# Altium schematic sheet Converter.SchDoc: 24-12V 3A Converter TPS62933
size A4; DrawnBy: EEE Patrick; Organization: PERT; Revision: A; SheetNumber: 1; SheetTotal: 1; Version: 1; Sub Team: EEE; Module: Converter; Generation: NA
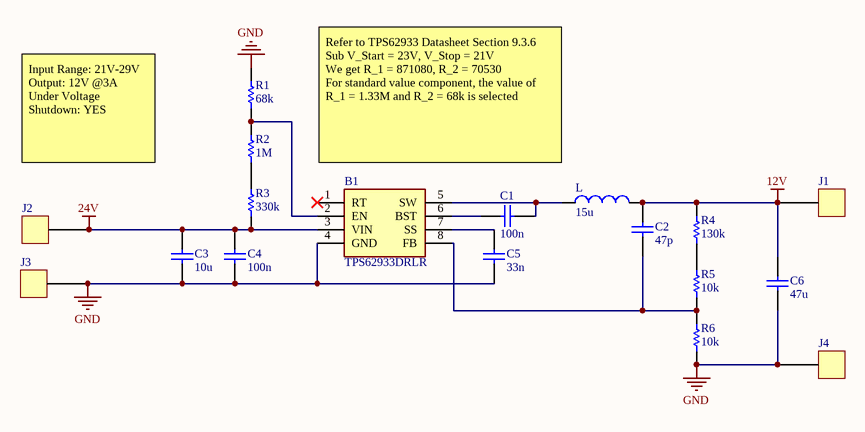
[diagram p0: Converter.SchDoc]

## Parts
B1  TPS62933DRLR  [SOT583_TPS62933]
C1  100n  [0603_SMD_C]
C2  47p  [0603_SMD_C]
C3  10u  [1206_SMD_C]
C4  100n  [0805_SMD_C]
C5  33n  [0603_SMD_C]
C6  47u  [1210_SMD_C]
J1  CastellatedHoles  [CastellatedHole]  (value not drawn)  (no BOM)
J2  CastellatedHoles  [CastellatedHole]  (value not drawn)  (no BOM)
J3  CastellatedHoles  [CastellatedHole]  (value not drawn)  (no BOM)
J4  CastellatedHoles  [CastellatedHole]  (value not drawn)  (no BOM)
L  15u  [DR127_SMD_L]
R1  68k  [0603_SMD_R]
R2  1M  [0603_SMD_R]
R3  330k  [0603_SMD_R]
R4  130k  [0603_SMD_R]
R5  10k  [0603_SMD_R]
R6  10k  [0603_SMD_R]

## Nets
12V: C2.2 C6.2 J1.1 L.1 R4.2
24V: B1.3(VIN) C3.2 C4.2 J2.1 R3.1
GND: B1.4(GND) C3.1 C4.1 C5.1 C6.1 J3.1 J4.1 R1.2 R6.1
NetB1_2: B1.2(EN) R1.1 R2.2
NetB1_5: B1.5(SW) C1.2 L.2
NetB1_6: B1.6(BST) C1.1
NetB1_7: B1.7(SS) C5.2
NetB1_8: B1.8(FB) C2.1 R5.1 R6.2
NetR2_1: R2.1 R3.2
NetR4_1: R4.1 R5.2

Not connected (* = marked no-connect by the designer): B1 1(RT)*

## Notes on the sheet
- Input Range: 21V-29V
  Output: 12V @3A
  Under Voltage Shutdown: YES
- Refer to TPS62933 Datasheet Section 9.3.6
  Sub V_Start = 23V, V_Stop = 21V
  We get R_1 = 871080, R_2 = 70530
  For standard value component, the value of R_1 = 1.33M and R_2 = 68k is selected
- Title
- Generation
- Organization
- Sub Team
- Module
- Ver.
- Rev.
- Date
- Drawn By

## Library data of the parts
B1 = TPS62933DRLR: The TPS62933 is a high-efficiency, easy-to-use synchronous buck converter with a wide input voltage range of 3.8 V to 30 V; Manufacturer_Name: Texas Instruments; Geometry.Height: 0.6mm; Mouser Part Number: 595-TPS62933DRLR; Mouser Price/Stock: https://www.mouser.co.uk/ProductDetail/Texas-Instruments/TPS62933DRLR?qs=Rp5uXu7WBW9fv47wfQVntQ%3D%3D; Manufacturer_Part_Number: TPS62933DRLR; Datasheet Link: https://www.ti.com/lit/ds/symlink/tps62933.pdf?ts=1626073394234
C1 C2 C5 = 0603_SMD_Capacitor: 0603 SMD Capacitor; Voltage Rating: *; Tolerance: *; Dielectric: *
  C1: Value: 100n
  C2: Value: 47p
  C5: Value: 33n
C3 = 1206_SMD_Capacitor: 1206 SMD Capacitor; Voltage Rating: *; Tolerance: *; Dielectric: *; Value: 10u
C4 = 0805_SMD_Capacitor: 0805 SMD Capacitor; Voltage Rating: *; Tolerance: *; Dielectric: *; Value: 100n
C6 = 1210_SMD_Capacitor: 1210 SMD Capacitor; Voltage Rating: *; Tolerance: *; Dielectric: *; Value: 47u
L = DR127-150-R: 15ÂµH Shielded Wirewound Inductor 5.03A 24.7mOhm Nonstandard; MF: Coiltronics; Package: Nonstandard Coiltronics; MP: DR127-150-R; Price: None; Availability: Unavailable; SnapEDA_Link: https://www.snapeda.com/parts/DR127-150-R/Coiltronics/view-part/547540/?ref=snap; Value: 15u
R1-R6 = 0603_SMD_Resistor: 0603 SMD Resistor; Tolerance: *; Power Rating: *; Temperature Coefficient: *
  R1: Value: 68k
  R2: Value: 1M
  R3: Value: 330k
  R4: Value: 130k
  R5 R6: Value: 10k